# Altium schematic sheet 1.8-TFT-128x160.SchDoc: 1.8-TFT-128x160
size A4; Organization: Altium Limited; Address1: L3, 12a Rodborough Rd; Address2: Frenchs Forest; Address3: NSW; Address4: Australia 2086; DocumentNumber: 1; Revision: V1.0; SheetNumber: 1; SheetTotal: 1; Designer: 樊浩柏
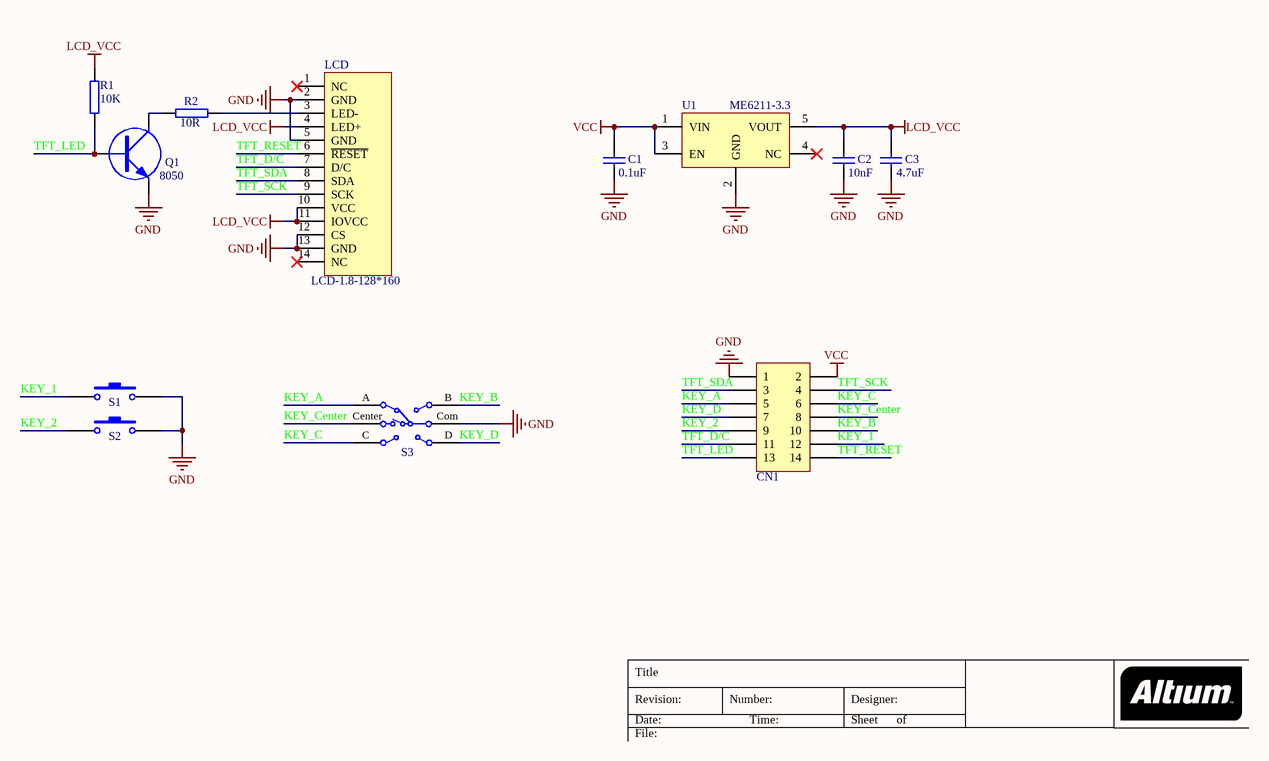
[diagram p0: 1.8-TFT-128x160.SchDoc]

## Parts
C1  0.1uF  [CAP-0603]
C2  10nF  [CAP-0603]
C3  4.7uF  [CAP-0603]
CN1  CON-7X2  [Pin-Header-2.00-Straight_SMD-14]  (value not drawn)
LCD  LCD-1.8-128*160  [LCD-1.8-128*160-14P]
Q1  8050  [SOT-23-3]
R1  10K  [RES-0603]
R2  10R  [RES-0603]
S1  Key  [SW-PB-2]  (value not drawn)
S2  Key  [SW-PB-2]  (value not drawn)
S3  Switch  [SW-ALPS-5]  (value not drawn)
U1  ME6211-3.3  [SOT-23-5]

## Nets
GND: C1.1 C2.1 C3.1 CN1.1 LCD.2(GND) LCD.5(GND) LCD.12(CS) LCD.13(GND) Q1.2(E) S1.2 S2.2 S3.5 U1.2(GND)
LCD_VCC: C2.2 C3.2 LCD.4(LED+) LCD.10(VCC) LCD.11(IOVCC) R1.2 U1.5(VOUT)
VCC: C1.2 CN1.2 U1.1(VIN) U1.3(EN)
KEY_1: CN1.12 S1.1
KEY_2: CN1.9 S2.1
KEY_A: CN1.5 S3.1
KEY_B: CN1.10 S3.4
KEY_C: CN1.6 S3.3
KEY_Center: CN1.8 S3.2
KEY_D: CN1.7 S3.6
TFT_D/C: CN1.11 LCD.7(D/C)
TFT_LED: CN1.13 Q1.1(B) R1.1
TFT_RESET: CN1.14 LCD.6(~{RESET})
TFT_SCK: CN1.4 LCD.9(SCK)
TFT_SDA: CN1.3 LCD.8(SDA)
NetLCD_3: LCD.3(LED-) R2.2
NetQ1_3: Q1.3(C) R2.1

Not connected (* = marked no-connect by the designer): LCD 1(NC)* 14(NC)*; U1 4(NC)*

## Notes on the sheet
- Title
- Revision:
- Date:
- Number:
- Time:
- Designer:
- Sheet
- of
- File:
- (in symbol Switch-ALPS-5) A; B; Center; Com; C; D

## Library data of the parts
C1-C3 = Cap
LCD = LCD-1.8-128*160-14P
Q1 = NPN
R1 R2 = Res
S1 S2 = Key-PB-2
S3 = Switch-ALPS-5
U1 = LDO: Published: 24-Mar-1999; LatestRevisionDate: 29-May-2009; LatestRevisionNote: IPC-7351 Footprint Added.; PackageReference: D2PAK; Publisher: Altium Limited; PackageDescription: 3-Pin Transistor Outline Package 2.54 mm Pitch, 15.1 mm Lead Span